# EAGLE design daughter_v2 (EAGLE 9.6.2)
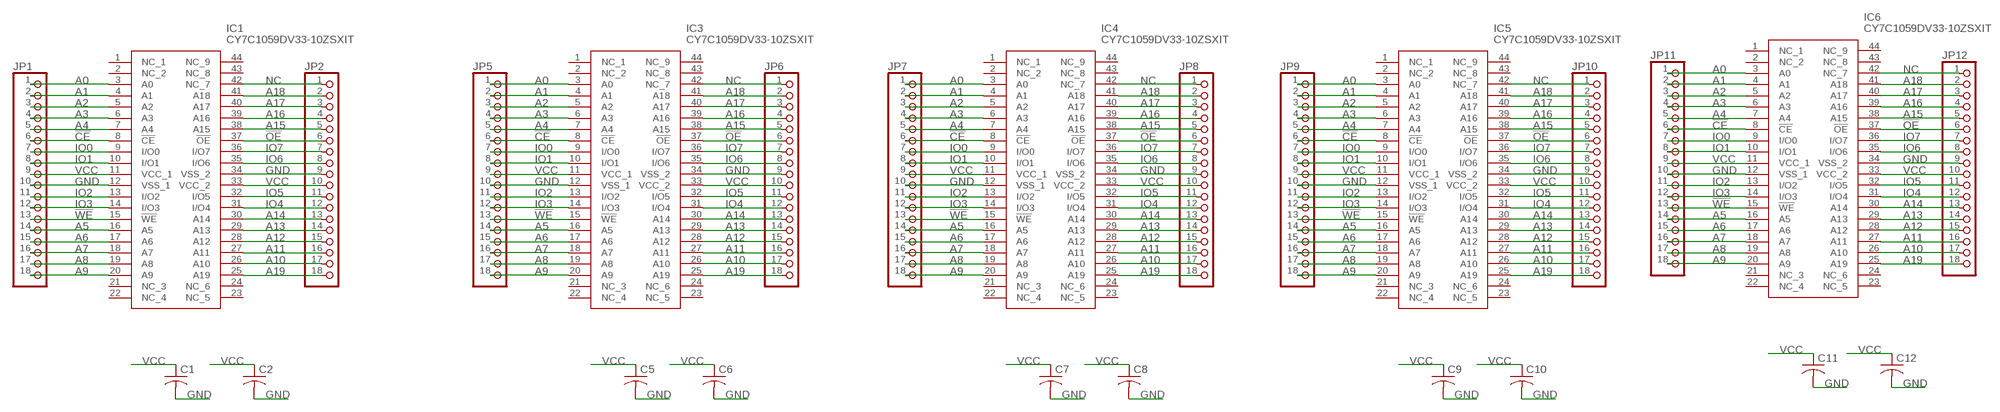
[diagram p0: schematic, sheet 1]

## Parts
C1  C-USC0805  [C0805]
C2  C-USC0805  [C0805]
C5  C-USC0805  [C0805]
C6  C-USC0805  [C0805]
C7  C-USC0805  [C0805]
C8  C-USC0805  [C0805]
C9  C-USC0805  [C0805]
C10  C-USC0805  [C0805]
C11  C-USC0805  [C0805]
C12  C-USC0805  [C0805]
IC1  CY7C1059DV33-10ZSXIT  [SOP80P1184X119-44N]
IC3  CY7C1059DV33-10ZSXIT  [SOP80P1184X119-44N]
IC4  CY7C1059DV33-10ZSXIT  [SOP80P1184X119-44N]
IC5  CY7C1059DV33-10ZSXIT  [SOP80P1184X119-44N]
IC6  CY7C1059DV33-10ZSXIT  [SOP80P1184X119-44N]
JP1  PINHD-1X18  [1X18]
JP2  PINHD-1X18  [1X18]
JP5  PINHD-1X18  [1X18]
JP6  PINHD-1X18  [1X18]
JP7  PINHD-1X18  [1X18]
JP8  PINHD-1X18  [1X18]
JP9  PINHD-1X18  [1X18]
JP10  PINHD-1X18  [1X18]
JP11  PINHD-1X18  [1X18]
JP12  PINHD-1X18  [1X18]

## Nets
!CE: IC1.8(!CE) IC3.8(!CE) IC4.8(!CE) IC5.8(!CE) IC6.8(!CE) JP1.6 JP5.6 JP7.6 JP9.6 JP11.6
!OE: IC1.37(!OE) IC3.37(!OE) IC4.37(!OE) IC5.37(!OE) IC6.37(!OE) JP2.6 JP6.6 JP8.6 JP10.6 JP12.6
!WE: IC1.15(!WE) IC3.15(!WE) IC4.15(!WE) IC5.15(!WE) IC6.15(!WE) JP1.13 JP5.13 JP7.13 JP9.13 JP11.13
A0: IC1.3(A0) IC3.3(A0) IC4.3(A0) IC5.3(A0) IC6.3(A0) JP1.1 JP5.1 JP7.1 JP9.1 JP11.1
A1: IC1.4(A1) IC3.4(A1) IC4.4(A1) IC5.4(A1) IC6.4(A1) JP1.2 JP5.2 JP7.2 JP9.2 JP11.2
A2: IC1.5(A2) IC3.5(A2) IC4.5(A2) IC5.5(A2) IC6.5(A2) JP1.3 JP5.3 JP7.3 JP9.3 JP11.3
A3: IC1.6(A3) IC3.6(A3) IC4.6(A3) IC5.6(A3) IC6.6(A3) JP1.4 JP5.4 JP7.4 JP9.4 JP11.4
A4: IC1.7(A4) IC3.7(A4) IC4.7(A4) IC5.7(A4) IC6.7(A4) JP1.5 JP5.5 JP7.5 JP9.5 JP11.5
A5: IC1.16(A5) IC3.16(A5) IC4.16(A5) IC5.16(A5) IC6.16(A5) JP1.14 JP5.14 JP7.14 JP9.14 JP11.14
A6: IC1.17(A6) IC3.17(A6) IC4.17(A6) IC5.17(A6) IC6.17(A6) JP1.15 JP5.15 JP7.15 JP9.15 JP11.15
A7: IC1.18(A7) IC3.18(A7) IC4.18(A7) IC5.18(A7) IC6.18(A7) JP1.16 JP5.16 JP7.16 JP9.16 JP11.16
A8: IC1.19(A8) IC3.19(A8) IC4.19(A8) IC5.19(A8) IC6.19(A8) JP1.17 JP5.17 JP7.17 JP9.17 JP11.17
A9: IC1.20(A9) IC3.20(A9) IC4.20(A9) IC5.20(A9) IC6.20(A9) JP1.18 JP5.18 JP7.18 JP9.18 JP11.18
A10: IC1.26(A10) IC3.26(A10) IC4.26(A10) IC5.26(A10) IC6.26(A10) JP2.17 JP6.17 JP8.17 JP10.17 JP12.17
A11: IC1.27(A11) IC3.27(A11) IC4.27(A11) IC5.27(A11) IC6.27(A11) JP2.16 JP6.16 JP8.16 JP10.16 JP12.16
A12: IC1.28(A12) IC3.28(A12) IC4.28(A12) IC5.28(A12) IC6.28(A12) JP2.15 JP6.15 JP8.15 JP10.15 JP12.15
A13: IC1.29(A13) IC3.29(A13) IC4.29(A13) IC5.29(A13) IC6.29(A13) JP2.14 JP6.14 JP8.14 JP10.14 JP12.14
A14: IC1.30(A14) IC3.30(A14) IC4.30(A14) IC5.30(A14) IC6.30(A14) JP2.13 JP6.13 JP8.13 JP10.13 JP12.13
A15: IC1.38(A15) IC3.38(A15) IC4.38(A15) IC5.38(A15) IC6.38(A15) JP2.5 JP6.5 JP8.5 JP10.5 JP12.5
A16: IC1.39(A16) IC3.39(A16) IC4.39(A16) IC5.39(A16) IC6.39(A16) JP2.4 JP6.4 JP8.4 JP10.4 JP12.4
A17: IC1.40(A17) IC3.40(A17) IC4.40(A17) IC5.40(A17) IC6.40(A17) JP2.3 JP6.3 JP8.3 JP10.3 JP12.3
A18: IC1.41(A18) IC3.41(A18) IC4.41(A18) IC5.41(A18) IC6.41(A18) JP2.2 JP6.2 JP8.2 JP10.2 JP12.2
A19: IC1.25(A19) IC3.25(A19) IC4.25(A19) IC5.25(A19) IC6.25(A19) JP2.18 JP6.18 JP8.18 JP10.18 JP12.18
GND: C1.2 C2.2 C5.2 C6.2 C7.2 C8.2 C9.2 C10.2 C11.2 C12.2 IC1.12(VSS_1) IC1.34(VSS_2) IC3.12(VSS_1) IC3.34(VSS_2) IC4.12(VSS_1) IC4.34(VSS_2) IC5.12(VSS_1) IC5.34(VSS_2) IC6.12(VSS_1) IC6.34(VSS_2) JP1.10 JP2.9 JP5.10 JP6.9 JP7.10 JP8.9 JP9.10 JP10.9 JP11.10 JP12.9
IO0: IC1.9(I/O0) IC3.9(I/O0) IC4.9(I/O0) IC5.9(I/O0) IC6.9(I/O0) JP1.7 JP5.7 JP7.7 JP9.7 JP11.7
IO1: IC1.10(I/O1) IC3.10(I/O1) IC4.10(I/O1) IC5.10(I/O1) IC6.10(I/O1) JP1.8 JP5.8 JP7.8 JP9.8 JP11.8
IO2: IC1.13(I/O2) IC3.13(I/O2) IC4.13(I/O2) IC5.13(I/O2) IC6.13(I/O2) JP1.11 JP5.11 JP7.11 JP9.11 JP11.11
IO3: IC1.14(I/O3) IC3.14(I/O3) IC4.14(I/O3) IC5.14(I/O3) IC6.14(I/O3) JP1.12 JP5.12 JP7.12 JP9.12 JP11.12
IO4: IC1.31(I/O4) IC3.31(I/O4) IC4.31(I/O4) IC5.31(I/O4) IC6.31(I/O4) JP2.12 JP6.12 JP8.12 JP10.12 JP12.12
IO5: IC1.32(I/O5) IC3.32(I/O5) IC4.32(I/O5) IC5.32(I/O5) IC6.32(I/O5) JP2.11 JP6.11 JP8.11 JP10.11 JP12.11
IO6: IC1.35(I/O6) IC3.35(I/O6) IC4.35(I/O6) IC5.35(I/O6) IC6.35(I/O6) JP2.8 JP6.8 JP8.8 JP10.8 JP12.8
IO7: IC1.36(I/O7) IC3.36(I/O7) IC4.36(I/O7) IC5.36(I/O7) IC6.36(I/O7) JP2.7 JP6.7 JP8.7 JP10.7 JP12.7
NC: IC1.42(NC_7) IC3.42(NC_7) IC4.42(NC_7) IC5.42(NC_7) IC6.42(NC_7) JP2.1 JP6.1 JP8.1 JP10.1 JP12.1
VCC: C1.1 C2.1 C5.1 C6.1 C7.1 C8.1 C9.1 C10.1 C11.1 C12.1 IC1.11(VCC_1) IC1.33(VCC_2) IC3.11(VCC_1) IC3.33(VCC_2) IC4.11(VCC_1) IC4.33(VCC_2) IC5.11(VCC_1) IC5.33(VCC_2) IC6.11(VCC_1) IC6.33(VCC_2) JP1.9 JP2.10 JP5.9 JP6.10 JP7.9 JP8.10 JP9.9 JP10.10 JP11.9 JP12.10
Unconnected: IC1.1(NC_1) IC1.2(NC_2) IC1.21(NC_3) IC1.22(NC_4) IC1.23(NC_5) IC1.24(NC_6) IC1.43(NC_8) IC1.44(NC_9) IC3.1(NC_1) IC3.2(NC_2) IC3.21(NC_3) IC3.22(NC_4) IC3.23(NC_5) IC3.24(NC_6) IC3.43(NC_8) IC3.44(NC_9) IC4.1(NC_1) IC4.2(NC_2) IC4.21(NC_3) IC4.22(NC_4) IC4.23(NC_5) IC4.24(NC_6) IC4.43(NC_8) IC4.44(NC_9) IC5.1(NC_1) IC5.2(NC_2) IC5.21(NC_3) IC5.22(NC_4) IC5.23(NC_5) IC5.24(NC_6) IC5.43(NC_8) IC5.44(NC_9) IC6.1(NC_1) IC6.2(NC_2) IC6.21(NC_3) IC6.22(NC_4) IC6.23(NC_5) IC6.24(NC_6) IC6.43(NC_8) IC6.44(NC_9)

## Library data of the parts
C1 C2 C5-C12 = rcl:C-US: CAPACITOR, American symbol; SPICEPREFIX: C
IC1 IC3-IC6 = SamacSys_Parts:CY7C1059DV33-10ZSXIT: SRAM 8MB (1Mx8) 3.3v 10ns Fast Async SRAM Source: Datasheet <https://componentsearchengine.com/Datasheets/1/CY7C1059DV33-10ZSXIT.pdf>; ARROW_PART_NUMBER: CY7C1059DV33-10ZSXIT; ARROW_PRICE-STOCK: https://www.arrow.com/en/products/cy7c1059dv33-10zsxit/cypress-semiconductor?region=nac; DESCRIPTION: SRAM 8MB (1Mx8) 3.3v 10ns Fast Async SRAM; HEIGHT: 1.194mm; MANUFACTURER_NAME: Cypress Semiconductor; MANUFACTURER_PART_NUMBER: CY7C1059DV33-10ZSXIT; MOUSER_PART_NUMBER: 727-C1059DV3310ZSXIT; MOUSER_PRICE-STOCK: https://www.mouser.co.uk/ProductDetail/Cypress-Semiconductor/CY7C1059DV33-10ZSXIT?qs=k2piNBSag38I1iaL2AXkLQ%3D%3D
JP1 JP2 JP5-JP12 = pinhead:PINHD-1X18: PIN HEADER

## Board
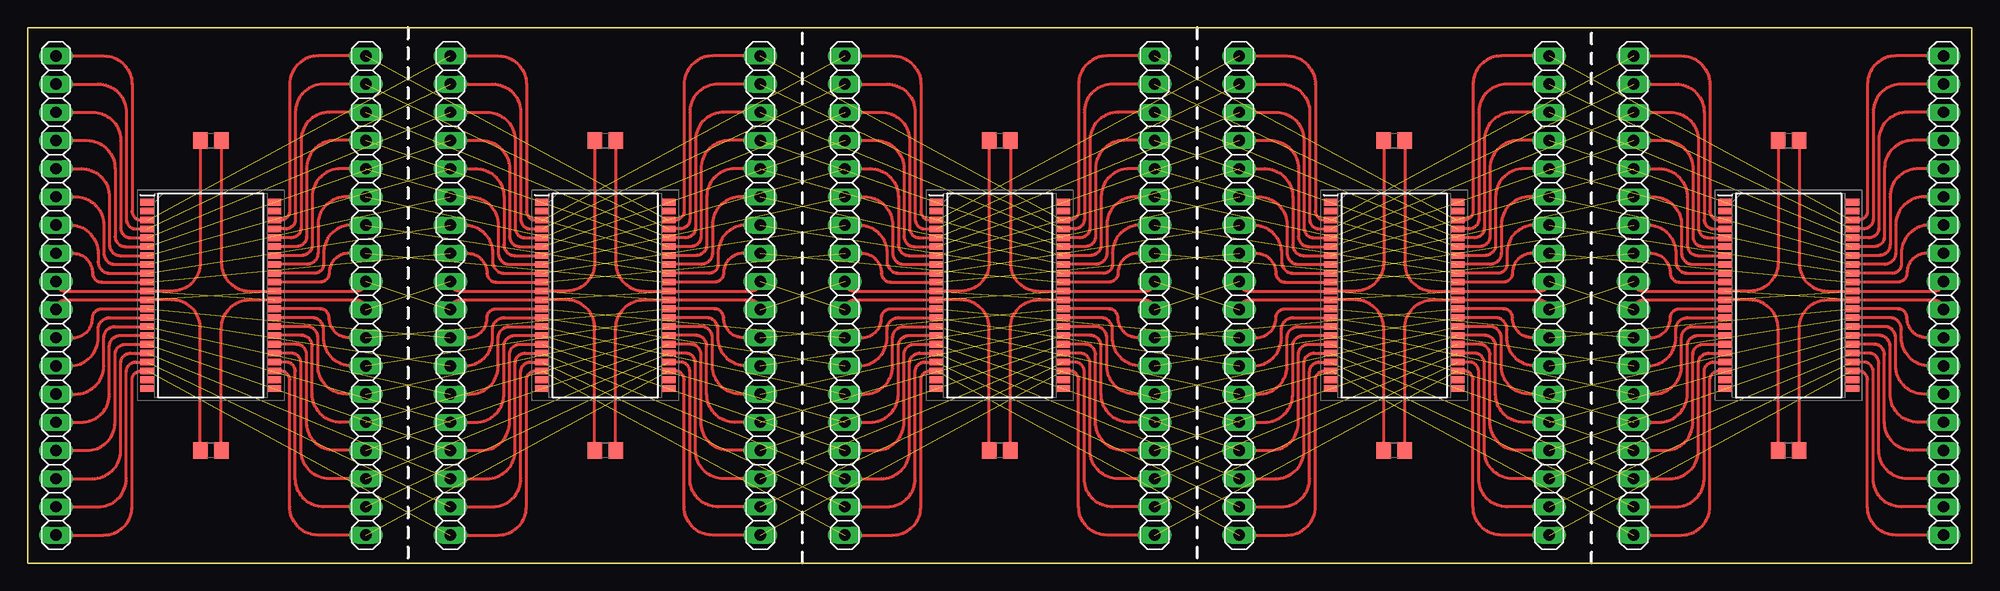
[diagram p1: board, top side]
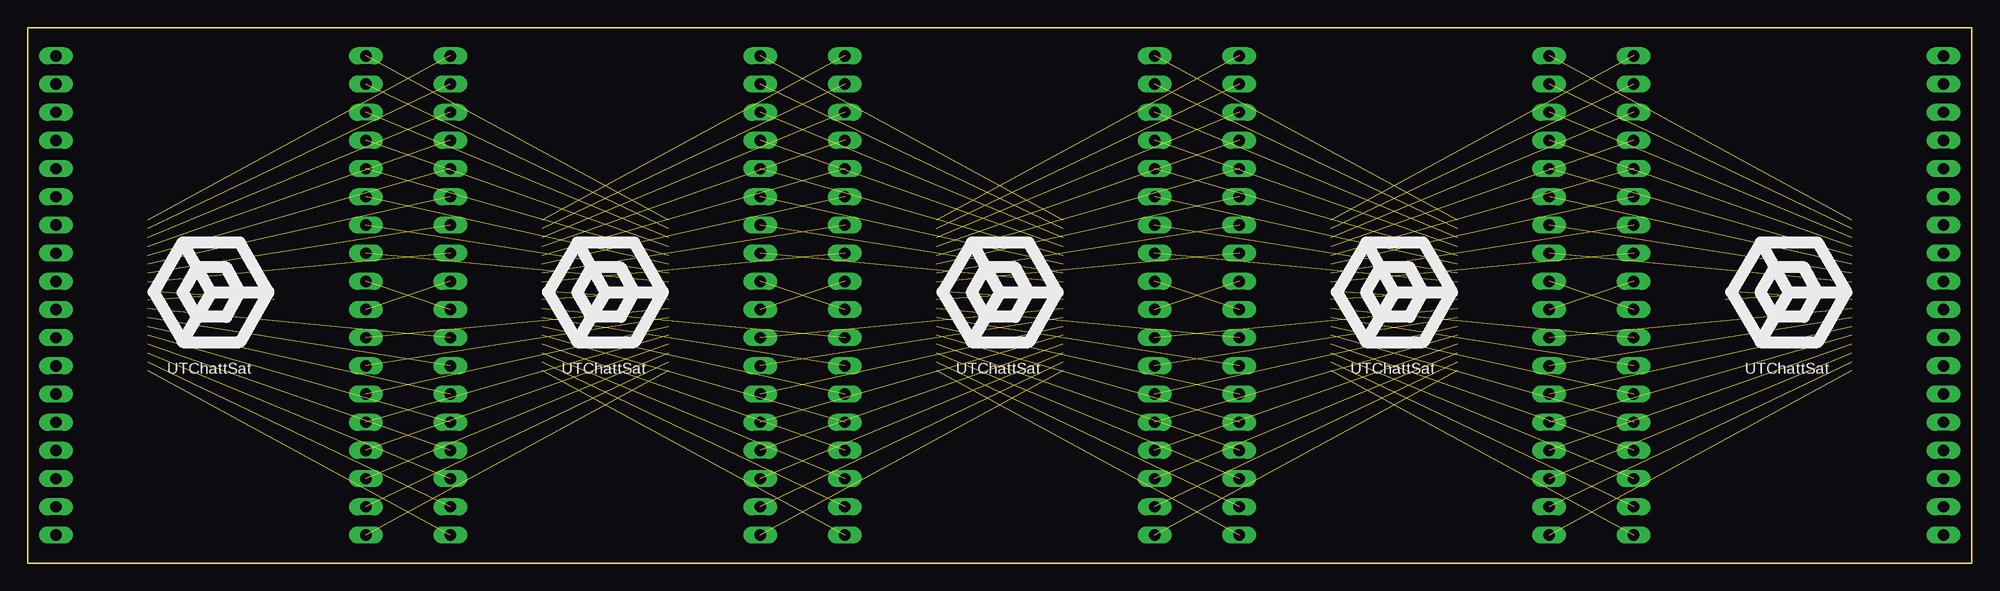
[diagram p2: board, bottom side, seen from below]

Size 175.26 x 48.26 mm. Coordinates in mm from the lower left corner, seen from the top.
Outline: 0,0 175.26,0 175.26,48.26 0,48.26 0,0
Copper layers (1*16): Top 0.035mm / dielectric 0.2mm / Bottom 0.035mm
Design rules "jlcpcb-2-layer *": minimum track width 3.5mil, minimum drill 0.2mm, track to track 3.5mil, track to pad 10mil, pad to pad 5mil, via to via 5mil, smd to smd 0mil, copper to edge 0.1mm, drill to drill 5mil, minimum pad ring 4mil, minimum via ring 4mil, stop-mask expansion 3mil, vias tented up to drill 100mil, thermal gap 10mil

### Footprints (pad centres in the part's own frame; a part is rotated, then mirrored left to right if it is on the bottom)
C0805 = smd 1.3 x 1.5: 1 -0.95,0; 2 0.95,0
SOP80P1184X119-44N = smd 1.27 x 0.6: 1 -5.715,8.4; 2 -5.715,7.6; 3 -5.715,6.8; 4 -5.715,6; 5 -5.715,5.2; 6 -5.715,4.4; 7 -5.715,3.6; 8 -5.715,2.8; 9 -5.715,2; 10 -5.715,1.2; 11 -5.715,0.4; 12 -5.715,-0.4; 13 -5.715,-1.2; 14 -5.715,-2; 15 -5.715,-2.8; 16 -5.715,-3.6; 17 -5.715,-4.4; 18 -5.715,-5.2; 19 -5.715,-6; 20 -5.715,-6.8; 21 -5.715,-7.6; 22 -5.715,-8.4; 23 5.715,-8.4; 24 5.715,-7.6; 25 5.715,-6.8; 26 5.715,-6; 27 5.715,-5.2; 28 5.715,-4.4; 29 5.715,-3.6; 30 5.715,-2.8; 31 5.715,-2; 32 5.715,-1.2; 33 5.715,-0.4; 34 5.715,0.4; 35 5.715,1.2; 36 5.715,2; 37 5.715,2.8; 38 5.715,3.6; 39 5.715,4.4; 40 5.715,5.2; 41 5.715,6; 42 5.715,6.8; 43 5.715,7.6; 44 5.715,8.4
1X18 = drill 1.016 long: 1 -21.59,0; 2 -19.05,0; 3 -16.51,0; 4 -13.97,0; 5 -11.43,0; 6 -8.89,0; 7 -6.35,0; 8 -3.81,0; 9 -1.27,0; 10 1.27,0; 11 3.81,0; 12 6.35,0; 13 8.89,0; 14 11.43,0; 15 13.97,0; 16 16.51,0; 17 19.05,0; 18 21.59,0

### Placement (x,y rotation side)
C1  16.51,38.1 0 top
C2  16.51,10.16 180 top
C5  52.07,38.1 0 top
C6  52.07,10.16 180 top
C7  87.63,38.1 0 top
C8  87.63,10.16 180 top
C9  123.19,38.1 0 top
C10  123.19,10.16 180 top
C11  158.75,38.1 0 top
C12  158.75,10.16 180 top
IC1  16.51,24.13 0 top
IC3  52.07,24.13 0 top
IC4  87.63,24.13 0 top
IC5  123.19,24.13 0 top
IC6  158.75,24.13 0 top
JP1  2.54,24.13 270 top
JP2  30.48,24.13 270 top
JP5  38.1,24.13 270 top
JP6  66.04,24.13 270 top
JP7  73.66,24.13 270 top
JP8  101.6,24.13 270 top
JP9  109.22,24.13 270 top
JP10  137.16,24.13 270 top
JP11  144.78,24.13 270 top
JP12  172.72,24.13 270 top

### Tracks (layer width: path | path; a pad name or v marks a point on that pad's centre or on a via)
!CE  (4 unrouted)
  Top 0.254: JP1.6 4.32,33.02 arc-90 6.86,30.48 6.86,27.94 arc90 7.87,26.93 IC1.8 | JP5.6 39.88,33.02 arc-90 42.42,30.48 42.42,27.94 arc90 43.43,26.93 IC3.8 | JP7.6 75.44,33.02 arc-90 77.98,30.48 77.98,27.94 arc90 78.99,26.93 IC4.8 | JP9.6 111,33.02 arc-90 113.54,30.48 113.54,27.94 arc90 114.55,26.93 IC5.8 | JP11.6 146.56,33.02 arc-90 149.1,30.48 149.1,27.94 arc90 150.11,26.93 IC6.8
!OE  (4 unrouted)
  Top 0.254: JP2.6 28.7,33.02 arc90 26.16,30.48 26.16,27.94 arc-90 25.15,26.93 IC1.37 | JP6.6 64.26,33.02 arc90 61.72,30.48 61.72,27.94 arc-90 60.71,26.93 IC3.37 | JP8.6 99.82,33.02 arc90 97.28,30.48 97.28,27.94 arc-90 96.27,26.93 IC4.37 | JP10.6 135.38,33.02 arc90 132.84,30.48 132.84,27.94 arc-90 131.83,26.93 IC5.37 | JP12.6 170.94,33.02 arc90 168.4,30.48 168.4,27.94 arc-90 167.39,26.93 IC6.37
!WE  (4 unrouted)
  Top 0.254: JP1.13 4.32,15.24 arc90 6.86,17.78 6.86,20.32 arc-90 7.87,21.33 IC1.15 | JP5.13 39.88,15.24 arc90 42.42,17.78 42.42,20.32 arc-90 43.43,21.33 IC3.15 | JP7.13 75.44,15.24 arc90 77.98,17.78 77.98,20.32 arc-90 78.99,21.33 IC4.15 | JP9.13 111,15.24 arc90 113.54,17.78 113.54,20.32 arc-90 114.55,21.33 IC5.15 | JP11.13 146.56,15.24 arc90 149.1,17.78 149.1,20.32 arc-90 150.11,21.33 IC6.15
A0  (4 unrouted)
  Top 0.254: JP1.1 6.86,45.72 arc-90 9.4,43.18 9.4,31.75 arc90 10.22,30.93 IC1.3 | JP5.1 42.42,45.72 arc-90 44.96,43.18 44.96,31.75 arc90 45.78,30.93 IC3.3 | JP7.1 77.98,45.72 arc-90 80.52,43.18 80.52,31.75 arc90 81.34,30.93 IC4.3 | JP9.1 113.54,45.72 arc-90 116.08,43.18 116.08,31.75 arc90 116.9,30.93 IC5.3 | JP11.1 149.1,45.72 arc-90 151.64,43.18 151.64,31.75 arc90 152.46,30.93 IC6.3
A1  (4 unrouted)
  Top 0.254: JP1.2 6.35,43.18 arc-90 8.89,40.64 8.89,30.99 arc90 9.75,30.13 IC1.4 | JP5.2 41.91,43.18 arc-90 44.45,40.64 44.45,30.99 arc90 45.31,30.13 IC3.4 | JP7.2 77.47,43.18 arc-90 80.01,40.64 80.01,30.99 arc90 80.87,30.13 IC4.4 | JP9.2 113.03,43.18 arc-90 115.57,40.64 115.57,30.99 arc90 116.43,30.13 IC5.4 | JP11.2 148.59,43.18 arc-90 151.13,40.64 151.13,30.99 arc90 151.99,30.13 IC6.4
A2  (4 unrouted)
  Top 0.254: JP1.3 5.84,40.64 arc-90 8.38,38.1 8.38,30.23 arc90 9.28,29.33 IC1.5 | JP5.3 41.4,40.64 arc-90 43.94,38.1 43.94,30.23 arc90 44.84,29.33 IC3.5 | JP7.3 76.96,40.64 arc-90 79.5,38.1 79.5,30.23 arc90 80.4,29.33 IC4.5 | JP9.3 112.52,40.64 arc-90 115.06,38.1 115.06,30.23 arc90 115.96,29.33 IC5.5 | JP11.3 148.08,40.64 arc-90 150.62,38.1 150.62,30.23 arc90 151.52,29.33 IC6.5
A3  (4 unrouted)
  Top 0.254: JP1.4 5.33,38.1 arc-90 7.87,35.56 7.87,29.46 arc90 8.81,28.53 IC1.6 | JP5.4 40.89,38.1 arc-90 43.43,35.56 43.43,29.46 arc90 44.37,28.53 IC3.6 | JP7.4 76.45,38.1 arc-90 78.99,35.56 78.99,29.46 arc90 79.93,28.53 IC4.6 | JP9.4 112.01,38.1 arc-90 114.55,35.56 114.55,29.46 arc90 115.49,28.53 IC5.6 | JP11.4 147.57,38.1 arc-90 150.11,35.56 150.11,29.46 arc90 151.05,28.53 IC6.6
A4  (4 unrouted)
  Top 0.254: JP1.5 4.83,35.56 arc-90 7.37,33.02 7.37,28.7 arc90 8.34,27.73 IC1.7 | JP5.5 40.39,35.56 arc-90 42.93,33.02 42.93,28.7 arc90 43.9,27.73 IC3.7 | JP7.5 75.95,35.56 arc-90 78.49,33.02 78.49,28.7 arc90 79.46,27.73 IC4.7 | JP9.5 111.51,35.56 arc-90 114.05,33.02 114.05,28.7 arc90 115.02,27.73 IC5.7 | JP11.5 147.07,35.56 arc-90 149.61,33.02 149.61,28.7 arc90 150.58,27.73 IC6.7
A5  (4 unrouted)
  Top 0.254: JP1.14 4.83,12.7 arc90 7.37,15.24 7.37,19.56 arc-90 8.34,20.53 IC1.16 | JP5.14 40.39,12.7 arc90 42.93,15.24 42.93,19.56 arc-90 43.9,20.53 IC3.16 | JP7.14 75.95,12.7 arc90 78.49,15.24 78.49,19.56 arc-90 79.46,20.53 IC4.16 | JP9.14 111.51,12.7 arc90 114.05,15.24 114.05,19.56 arc-90 115.02,20.53 IC5.16 | JP11.14 147.07,12.7 arc90 149.61,15.24 149.61,19.56 arc-90 150.58,20.53 IC6.16
A6  (4 unrouted)
  Top 0.254: JP1.15 5.33,10.16 arc90 7.87,12.7 7.87,18.8 arc-90 8.81,19.73 IC1.17 | JP5.15 40.89,10.16 arc90 43.43,12.7 43.43,18.8 arc-90 44.37,19.73 IC3.17 | JP7.15 76.45,10.16 arc90 78.99,12.7 78.99,18.8 arc-90 79.93,19.73 IC4.17 | JP9.15 112.01,10.16 arc90 114.55,12.7 114.55,18.8 arc-90 115.49,19.73 IC5.17 | JP11.15 147.57,10.16 arc90 150.11,12.7 150.11,18.8 arc-90 151.05,19.73 IC6.17
A7  (4 unrouted)
  Top 0.254: JP1.16 5.84,7.62 arc90 8.38,10.16 8.38,18.03 arc-90 9.28,18.93 IC1.18 | JP5.16 41.4,7.62 arc90 43.94,10.16 43.94,18.03 arc-90 44.84,18.93 IC3.18 | JP7.16 76.96,7.62 arc90 79.5,10.16 79.5,18.03 arc-90 80.4,18.93 IC4.18 | JP9.16 112.52,7.62 arc90 115.06,10.16 115.06,18.03 arc-90 115.96,18.93 IC5.18 | JP11.16 148.08,7.62 arc90 150.62,10.16 150.62,18.03 arc-90 151.52,18.93 IC6.18
A8  (4 unrouted)
  Top 0.254: JP1.17 6.35,5.08 arc90 8.89,7.62 8.89,17.27 arc-90 9.75,18.13 IC1.19 | JP5.17 41.91,5.08 arc90 44.45,7.62 44.45,17.27 arc-90 45.31,18.13 IC3.19 | JP7.17 77.47,5.08 arc90 80.01,7.62 80.01,17.27 arc-90 80.87,18.13 IC4.19 | JP9.17 113.03,5.08 arc90 115.57,7.62 115.57,17.27 arc-90 116.43,18.13 IC5.19 | JP11.17 148.59,5.08 arc90 151.13,7.62 151.13,17.27 arc-90 151.99,18.13 IC6.19
A9  (4 unrouted)
  Top 0.254: JP1.18 6.86,2.54 arc90 9.4,5.08 9.4,16.51 arc-90 10.22,17.33 IC1.20 | JP5.18 42.42,2.54 arc90 44.96,5.08 44.96,16.51 arc-90 45.78,17.33 IC3.20 | JP7.18 77.98,2.54 arc90 80.52,5.08 80.52,16.51 arc-90 81.34,17.33 IC4.20 | JP9.18 113.54,2.54 arc90 116.08,5.08 116.08,16.51 arc-90 116.9,17.33 IC5.20 | JP11.18 149.1,2.54 arc90 151.64,5.08 151.64,16.51 arc-90 152.46,17.33 IC6.20
A10  (4 unrouted)
  Top 0.254: JP2.17 26.67,5.08 arc-90 24.13,7.62 24.13,17.27 arc90 23.27,18.13 IC1.26 | JP6.17 62.23,5.08 arc-90 59.69,7.62 59.69,17.27 arc90 58.83,18.13 IC3.26 | JP8.17 97.79,5.08 arc-90 95.25,7.62 95.25,17.27 arc90 94.39,18.13 IC4.26 | JP10.17 133.35,5.08 arc-90 130.81,7.62 130.81,17.27 arc90 129.95,18.13 IC5.26 | JP12.17 168.91,5.08 arc-90 166.37,7.62 166.37,17.27 arc90 165.51,18.13 IC6.26
A11  (4 unrouted)
  Top 0.254: JP2.16 27.18,7.62 arc-90 24.64,10.16 24.64,18.03 arc90 23.74,18.93 IC1.27 | JP6.16 62.74,7.62 arc-90 60.2,10.16 60.2,18.03 arc90 59.3,18.93 IC3.27 | JP8.16 98.3,7.62 arc-90 95.76,10.16 95.76,18.03 arc90 94.86,18.93 IC4.27 | JP10.16 133.86,7.62 arc-90 131.32,10.16 131.32,18.03 arc90 130.42,18.93 IC5.27 | JP12.16 169.42,7.62 arc-90 166.88,10.16 166.88,18.03 arc90 165.98,18.93 IC6.27
A12  (4 unrouted)
  Top 0.254: JP2.15 27.69,10.16 arc-90 25.15,12.7 25.15,18.8 arc90 24.21,19.73 IC1.28 | JP6.15 63.25,10.16 arc-90 60.71,12.7 60.71,18.8 arc90 59.77,19.73 IC3.28 | JP8.15 98.81,10.16 arc-90 96.27,12.7 96.27,18.8 arc90 95.33,19.73 IC4.28 | JP10.15 134.37,10.16 arc-90 131.83,12.7 131.83,18.8 arc90 130.89,19.73 IC5.28 | JP12.15 169.93,10.16 arc-90 167.39,12.7 167.39,18.8 arc90 166.45,19.73 IC6.28
A13  (4 unrouted)
  Top 0.254: JP2.14 28.19,12.7 arc-90 25.65,15.24 25.65,19.56 arc90 24.68,20.53 IC1.29 | JP6.14 63.75,12.7 arc-90 61.21,15.24 61.21,19.56 arc90 60.24,20.53 IC3.29 | JP8.14 99.31,12.7 arc-90 96.77,15.24 96.77,19.56 arc90 95.8,20.53 IC4.29 | JP10.14 134.87,12.7 arc-90 132.33,15.24 132.33,19.56 arc90 131.36,20.53 IC5.29 | JP12.14 170.43,12.7 arc-90 167.89,15.24 167.89,19.56 arc90 166.92,20.53 IC6.29
A14  (4 unrouted)
  Top 0.254: JP2.13 28.7,15.24 arc-90 26.16,17.78 26.16,20.32 arc90 25.15,21.33 IC1.30 | JP6.13 64.26,15.24 arc-90 61.72,17.78 61.72,20.32 arc90 60.71,21.33 IC3.30 | JP8.13 99.82,15.24 arc-90 97.28,17.78 97.28,20.32 arc90 96.27,21.33 IC4.30 | JP10.13 135.38,15.24 arc-90 132.84,17.78 132.84,20.32 arc90 131.83,21.33 IC5.30 | JP12.13 170.94,15.24 arc-90 168.4,17.78 168.4,20.32 arc90 167.39,21.33 IC6.30
A15  (4 unrouted)
  Top 0.254: JP2.5 28.19,35.56 arc90 25.65,33.02 25.65,28.7 arc-90 24.68,27.73 IC1.38 | JP6.5 63.75,35.56 arc90 61.21,33.02 61.21,28.7 arc-90 60.24,27.73 IC3.38 | JP8.5 99.31,35.56 arc90 96.77,33.02 96.77,28.7 arc-90 95.8,27.73 IC4.38 | JP10.5 134.87,35.56 arc90 132.33,33.02 132.33,28.7 arc-90 131.36,27.73 IC5.38 | JP12.5 170.43,35.56 arc90 167.89,33.02 167.89,28.7 arc-90 166.92,27.73 IC6.38
A16  (4 unrouted)
  Top 0.254: JP2.4 27.69,38.1 arc90 25.15,35.56 25.15,29.46 arc-90 24.21,28.53 IC1.39 | JP6.4 63.25,38.1 arc90 60.71,35.56 60.71,29.46 arc-90 59.77,28.53 IC3.39 | JP8.4 98.81,38.1 arc90 96.27,35.56 96.27,29.46 arc-90 95.33,28.53 IC4.39 | JP10.4 134.37,38.1 arc90 131.83,35.56 131.83,29.46 arc-90 130.89,28.53 IC5.39 | JP12.4 169.93,38.1 arc90 167.39,35.56 167.39,29.46 arc-90 166.45,28.53 IC6.39
A17  (4 unrouted)
  Top 0.254: JP2.3 27.18,40.64 arc90 24.64,38.1 24.64,30.23 arc-90 23.74,29.33 IC1.40 | JP6.3 62.74,40.64 arc90 60.2,38.1 60.2,30.23 arc-90 59.3,29.33 IC3.40 | JP8.3 98.3,40.64 arc90 95.76,38.1 95.76,30.23 arc-90 94.86,29.33 IC4.40 | JP10.3 133.86,40.64 arc90 131.32,38.1 131.32,30.23 arc-90 130.42,29.33 IC5.40 | JP12.3 169.42,40.64 arc90 166.88,38.1 166.88,30.23 arc-90 165.98,29.33 IC6.40
A18  (4 unrouted)
  Top 0.254: JP2.2 26.67,43.18 arc90 24.13,40.64 24.13,30.99 arc-90 23.27,30.13 IC1.41 | JP6.2 62.23,43.18 arc90 59.69,40.64 59.69,30.99 arc-90 58.83,30.13 IC3.41 | JP8.2 97.79,43.18 arc90 95.25,40.64 95.25,30.99 arc-90 94.39,30.13 IC4.41 | JP10.2 133.35,43.18 arc90 130.81,40.64 130.81,30.99 arc-90 129.95,30.13 IC5.41 | JP12.2 168.91,43.18 arc90 166.37,40.64 166.37,30.99 arc-90 165.51,30.13 IC6.41
A19  (4 unrouted)
  Top 0.254: JP2.18 26.16,2.54 arc-90 23.62,5.08 23.62,16.51 arc90 22.8,17.33 IC1.25 | JP6.18 61.72,2.54 arc-90 59.18,5.08 59.18,16.51 arc90 58.36,17.33 IC3.25 | JP8.18 97.28,2.54 arc-90 94.74,5.08 94.74,16.51 arc90 93.92,17.33 IC4.25 | JP10.18 132.84,2.54 arc-90 130.3,5.08 130.3,16.51 arc90 129.48,17.33 IC5.25 | JP12.18 168.4,2.54 arc-90 165.86,5.08 165.86,16.51 arc90 165.04,17.33 IC6.25
GND  (9 unrouted)
  Top 0.254: JP1.10 arc-90 3.41,23.73 IC1.12 13.02,23.73 arc-90 15.56,21.19 C2.2 | JP2.9 arc-90 29.61,24.53 IC1.34 20,24.53 arc-90 17.46,27.07 C1.2 | JP5.10 arc-90 38.97,23.73 IC3.12 48.58,23.73 arc-90 51.12,21.19 C6.2 | JP6.9 arc-90 65.17,24.53 IC3.34 55.56,24.53 arc-90 53.02,27.07 C5.2 | JP7.10 arc-90 74.53,23.73 IC4.12 84.14,23.73 arc-90 86.68,21.19 C8.2 | JP8.9 arc-90 100.73,24.53 IC4.34 91.12,24.53 arc-90 88.58,27.07 C7.2 | JP9.10 arc-90 110.09,23.73 IC5.12 119.7,23.73 arc-90 122.24,21.19 C10.2 | JP10.9 arc-90 136.29,24.53 IC5.34 126.68,24.53 arc-90 124.14,27.07 C9.2 | JP11.10 arc-90 145.65,23.73 IC6.12 155.26,23.73 arc-90 157.8,21.19 C12.2 | JP12.9 arc-90 171.85,24.53 IC6.34 162.24,24.53 arc-90 159.7,27.07 C11.2
IO0  (4 unrouted)
  Top 0.254: JP1.7 3.81,30.48 arc-90 6.35,27.94 6.35,27.18 arc90 7.4,26.13 IC1.9 | JP5.7 39.37,30.48 arc-90 41.91,27.94 41.91,27.18 arc90 42.96,26.13 IC3.9 | JP7.7 74.93,30.48 arc-90 77.47,27.94 77.47,27.18 arc90 78.52,26.13 IC4.9 | JP9.7 110.49,30.48 arc-90 113.03,27.94 113.03,27.18 arc90 114.08,26.13 IC5.9 | JP11.7 146.05,30.48 arc-90 148.59,27.94 148.59,27.18 arc90 149.64,26.13 IC6.9
IO1  (4 unrouted)
  Top 0.254: JP1.8 4.06,27.94 arc-90 5.84,26.16 arc90 6.67,25.33 IC1.10 | JP5.8 39.62,27.94 arc-90 41.4,26.16 arc90 42.23,25.33 IC3.10 | JP7.8 75.18,27.94 arc-90 76.96,26.16 arc90 77.79,25.33 IC4.10 | JP9.8 110.74,27.94 arc-90 112.52,26.16 arc90 113.35,25.33 IC5.10 | JP11.8 146.3,27.94 arc-90 148.08,26.16 arc90 148.91,25.33 IC6.10
IO2  (4 unrouted)
  Top 0.254: JP1.11 4.06,20.32 arc90 5.84,22.1 arc-90 6.67,22.93 IC1.13 | JP5.11 39.62,20.32 arc90 41.4,22.1 arc-90 42.23,22.93 IC3.13 | JP7.11 75.18,20.32 arc90 76.96,22.1 arc-90 77.79,22.93 IC4.13 | JP9.11 110.74,20.32 arc90 112.52,22.1 arc-90 113.35,22.93 IC5.13 | JP11.11 146.3,20.32 arc90 148.08,22.1 arc-90 148.91,22.93 IC6.13
IO3  (4 unrouted)
  Top 0.254: JP1.12 3.81,17.78 arc90 6.35,20.32 6.35,21.08 arc-90 7.4,22.13 IC1.14 | JP5.12 39.37,17.78 arc90 41.91,20.32 41.91,21.08 arc-90 42.96,22.13 IC3.14 | JP7.12 74.93,17.78 arc90 77.47,20.32 77.47,21.08 arc-90 78.52,22.13 IC4.14 | JP9.12 110.49,17.78 arc90 113.03,20.32 113.03,21.08 arc-90 114.08,22.13 IC5.14 | JP11.12 146.05,17.78 arc90 148.59,20.32 148.59,21.08 arc-90 149.64,22.13 IC6.14
IO4  (4 unrouted)
  Top 0.254: JP2.12 29.21,17.78 arc-90 26.67,20.32 26.67,21.08 arc90 25.62,22.13 IC1.31 | JP6.12 64.77,17.78 arc-90 62.23,20.32 62.23,21.08 arc90 61.18,22.13 IC3.31 | JP8.12 100.33,17.78 arc-90 97.79,20.32 97.79,21.08 arc90 96.74,22.13 IC4.31 | JP10.12 135.89,17.78 arc-90 133.35,20.32 133.35,21.08 arc90 132.3,22.13 IC5.31 | JP12.12 171.45,17.78 arc-90 168.91,20.32 168.91,21.08 arc90 167.86,22.13 IC6.31
IO5  (4 unrouted)
  Top 0.254: JP2.11 28.96,20.32 arc-90 27.18,22.1 arc90 26.35,22.93 IC1.32 | JP6.11 64.52,20.32 arc-90 62.74,22.1 arc90 61.91,22.93 IC3.32 | JP8.11 100.08,20.32 arc-90 98.3,22.1 arc90 97.47,22.93 IC4.32 | JP10.11 135.64,20.32 arc-90 133.86,22.1 arc90 133.03,22.93 IC5.32 | JP12.11 171.2,20.32 arc-90 169.42,22.1 arc90 168.59,22.93 IC6.32
IO6  (4 unrouted)
  Top 0.254: JP2.8 28.96,27.94 arc90 27.18,26.16 arc-90 26.35,25.33 IC1.35 | JP6.8 64.52,27.94 arc90 62.74,26.16 arc-90 61.91,25.33 IC3.35 | JP8.8 100.08,27.94 arc90 98.3,26.16 arc-90 97.47,25.33 IC4.35 | JP10.8 135.64,27.94 arc90 133.86,26.16 arc-90 133.03,25.33 IC5.35 | JP12.8 171.2,27.94 arc90 169.42,26.16 arc-90 168.59,25.33 IC6.35
IO7  (4 unrouted)
  Top 0.254: JP2.7 29.21,30.48 arc90 26.67,27.94 26.67,26.92 arc-90 25.88,26.13 IC1.36 | JP6.7 64.77,30.48 arc90 62.23,27.94 62.23,26.92 arc-90 61.44,26.13 IC3.36 | JP8.7 100.33,30.48 arc90 97.79,27.94 97.79,26.92 arc-90 97,26.13 IC4.36 | JP10.7 135.89,30.48 arc90 133.35,27.94 133.35,26.92 arc-90 132.56,26.13 IC5.36 | JP12.7 171.45,30.48 arc90 168.91,27.94 168.91,26.92 arc-90 168.12,26.13 IC6.36
NC  (4 unrouted)
  Top 0.254: JP2.1 26.16,45.72 arc90 23.62,43.18 23.62,31.75 arc-90 22.8,30.93 IC1.42 | JP6.1 61.72,45.72 arc90 59.18,43.18 59.18,31.75 arc-90 58.36,30.93 IC3.42 | JP8.1 97.28,45.72 arc90 94.74,43.18 94.74,31.75 arc-90 93.92,30.93 IC4.42 | JP10.1 132.84,45.72 arc90 130.3,43.18 130.3,31.75 arc-90 129.48,30.93 IC5.42 | JP12.1 168.4,45.72 arc90 165.86,43.18 165.86,31.75 arc-90 165.04,30.93 IC6.42
VCC  (9 unrouted)
  Top 0.254: JP1.9 arc90 3.41,24.53 IC1.11 13.02,24.53 arc90 15.56,27.07 C1.1 | JP2.10 arc90 29.61,23.73 IC1.33 20,23.73 arc90 17.46,21.19 C2.1 | JP5.9 arc90 38.97,24.53 IC3.11 48.58,24.53 arc90 51.12,27.07 C5.1 | JP6.10 arc90 65.17,23.73 IC3.33 55.56,23.73 arc90 53.02,21.19 C6.1 | JP7.9 arc90 74.53,24.53 IC4.11 84.14,24.53 arc90 86.68,27.07 C7.1 | JP8.10 arc90 100.73,23.73 IC4.33 91.12,23.73 arc90 88.58,21.19 C8.1 | JP9.9 arc90 110.09,24.53 IC5.11 119.7,24.53 arc90 122.24,27.07 C9.1 | JP10.10 arc90 136.29,23.73 IC5.33 126.68,23.73 arc90 124.14,21.19 C10.1 | JP11.9 arc90 145.65,24.53 IC6.11 155.26,24.53 arc90 157.8,27.07 C11.1 | JP12.10 arc90 171.85,23.73 IC6.33 162.24,23.73 arc90 159.7,21.19 C12.1

### Text on the board
bPlace: UTChattSat | UTChattSat | UTChattSat | UTChattSat | UTChattSat